# EAGLE design power-control-template (EAGLE 6.4)
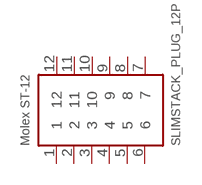
[diagram p0: schematic, sheet 1]

## Parts
U$1  SLIMSTACK_PLUG_12P  [SLIMSTACK-12P]
Unconnected: U$1.1 U$1.2 U$1.3 U$1.4 U$1.5 U$1.6 U$1.7 U$1.8 U$1.9 U$1.10 U$1.11 U$1.12

## Library data of the parts
U$1 = molex-slimstack:SLIMSTACK_PLUG_12P

## Board
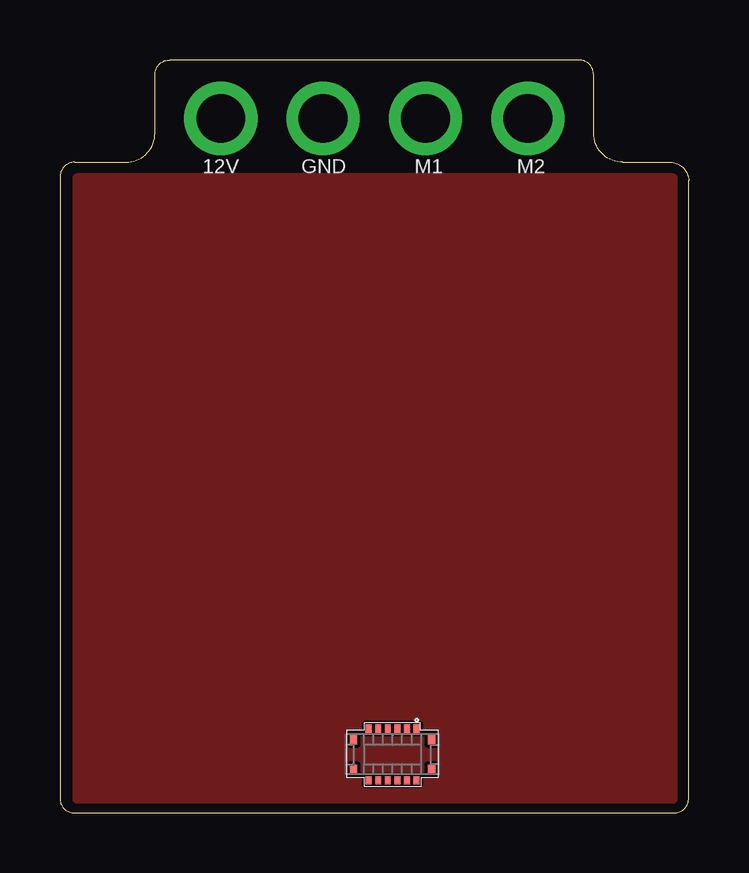
[diagram p1: board, top side]
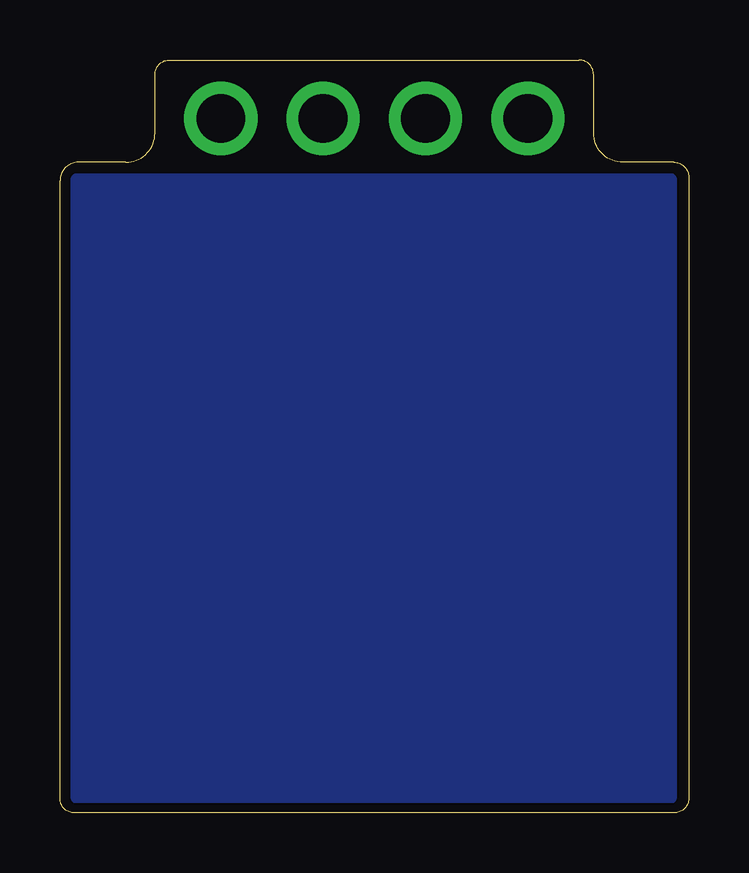
[diagram p2: board, bottom side, seen from below]

Size 26.21 x 31.39 mm. Coordinates in mm from the lower left corner, seen from the top.
Outline: 0.61,0 25.6,0 arc90 26.21,0.61 26.21,26.37 arc90 25.45,27.13 23.47,27.13 arc-90 22.25,28.35 22.25,30.78 arc90 21.64,31.39 4.57,31.39 arc90 3.96,30.78 3.96,28.35 arc-90 2.74,27.13 0.61,27.13 arc90 0,26.52 0,0.61 arc90 0.61,0
Copper layers (1*16): Top 0.0356mm / dielectric 1.5011mm / Bottom 0.0356mm
Design rules "LaenPCBOrder *": minimum track width 6mil, minimum drill 13mil, track to track 6mil, track to pad 6mil, pad to pad 6mil, via to via 6mil, smd to smd 6mil, copper to edge 15mil, drill to drill 6mil, minimum pad ring 7mil, minimum via ring 7mil, stop-mask expansion 4mil, vias tented up to drill 13mil, thermal gap 10mil

### Footprints (pad centres in the part's own frame; a part is rotated, then mirrored left to right if it is on the bottom)
SLIMSTACK-12P = smd 0.24 x 0.35: 1 -1,-1.075; 2 -0.6,-1.075; 3 -0.2,-1.075; 4 0.2,-1.075; 5 0.6,-1.075; 6 1,-1.075; 7 1,1.075; 8 0.6,1.075; 9 0.2,1.075; 10 -0.2,1.075; 11 -0.6,1.075; 12 -1,1.075 | smd 0.3 x 0.42: P$1 -1.63,0.63; P$2 1.63,0.63; P$3 -1.63,-0.63; P$4 1.63,-0.63

### Placement (x,y rotation side)
U$1  13.87,2.44 180 top

### Tracks (layer width: path | path; a pad name or v marks a point on that pad's centre or on a via)
GND
  pour Bottom (rank 6): 0.71,26.47 0.71,0.61 25.55,0.61 25.55,26.47
  pour Top (rank 6): 0.71,26.47 0.71,0.61 25.55,0.61 25.55,26.47
N$23  (via drill 2.03)
  other vias: 10.97,28.96
N$24  (via drill 2.03)
  other vias: 19.51,28.96
N$26  (via drill 2.03)
  other vias: 6.71,28.96
N$27  (via drill 2.03)
  other vias: 15.24,28.96

### Text on the board
tPlace: 12V | GND | M1 | M2